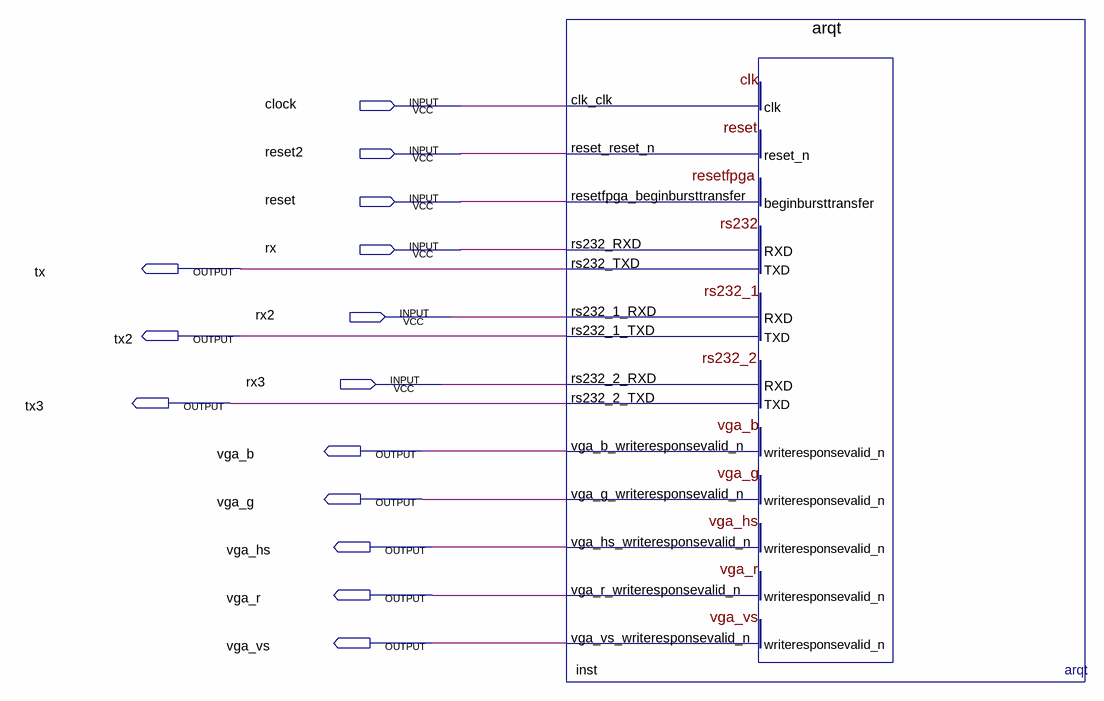
[diagram p0: schematic sheet]
// Quartus schematic problema3.bdf as structural Verilog: 1 symbols, 14 pins
module problema3 (
  input  clock,
  input  reset2,
  input  reset,
  input  rx,
  input  rx2,
  input  rx3,
  output tx,
  output tx2,
  output tx3,
  output vga_b,
  output vga_g,
  output vga_hs,
  output vga_r,
  output vga_vs
);

  arqt inst (
    .clk_clk(clock), .reset_reset_n(reset2), .resetfpga_beginbursttransfer(reset), .rs232_RXD(rx),
    .rs232_1_RXD(rx2), .rs232_2_RXD(rx3), .rs232_TXD(tx), .rs232_1_TXD(tx2), .rs232_2_TXD(tx3),
    .vga_b_writeresponsevalid_n(vga_b), .vga_g_writeresponsevalid_n(vga_g),
    .vga_hs_writeresponsevalid_n(vga_hs), .vga_r_writeresponsevalid_n(vga_r),
    .vga_vs_writeresponsevalid_n(vga_vs));
endmodule
